# EAGLE schematic umami-blade (EAGLE 9.6.2)
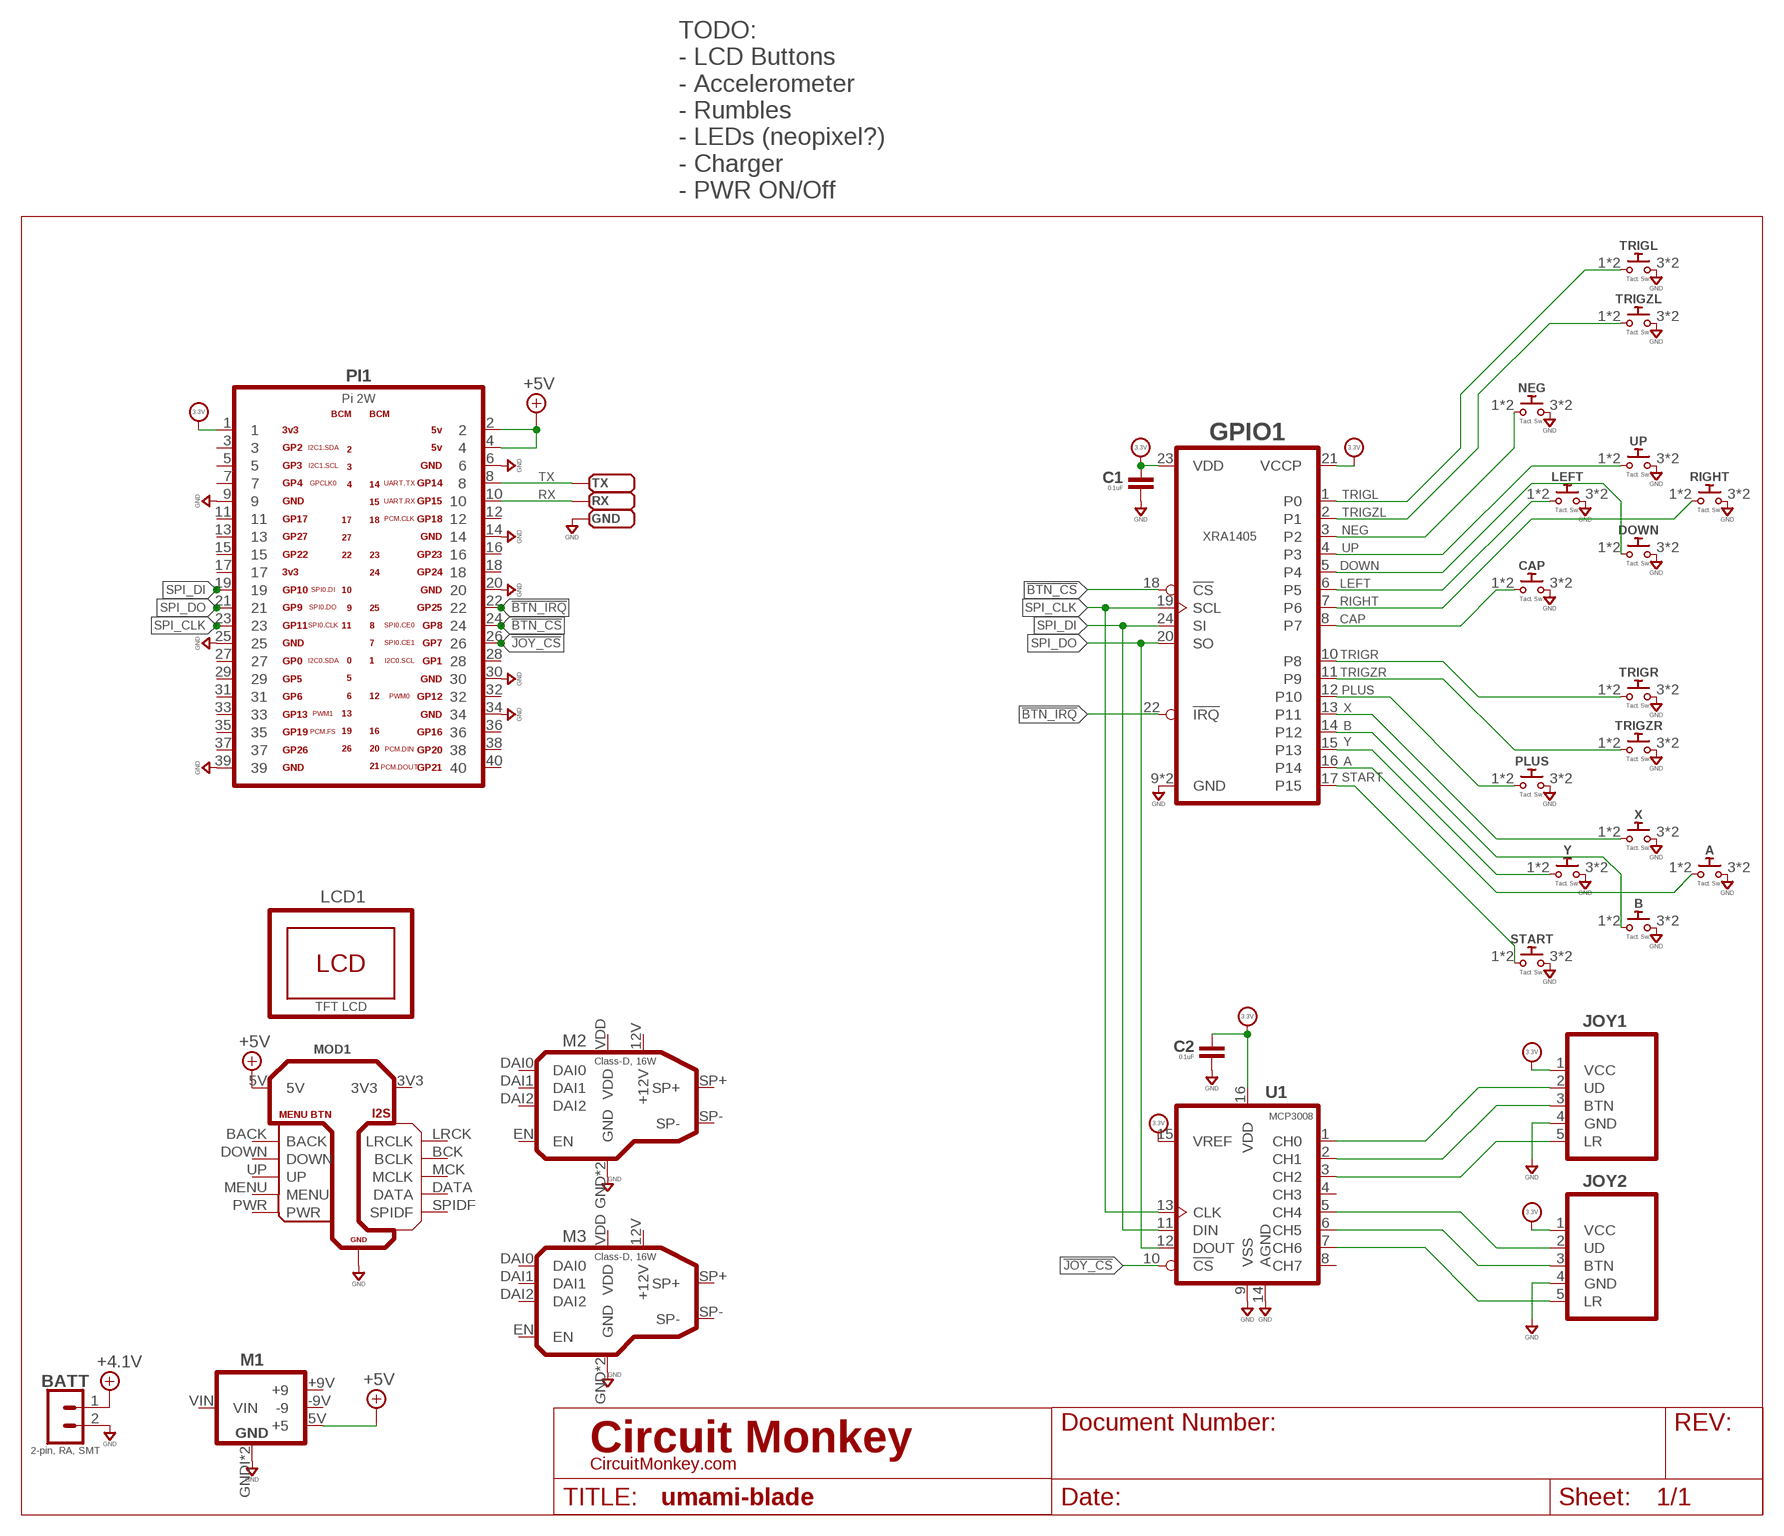
[diagram p0: schematic, sheet 1]

## Parts
A  Tact. Sw.  PUSHBTN-MOMB3FS  [B3FS]
B  Tact. Sw.  PUSHBTN-MOMB3FS  [B3FS]
BATT  2-pin, RA, SMT  02PRA-SMT  [S2B-PH-SM4-]
C1  0.1uF  CAPACITOR0603  [0603-CAP]
C2  0.1uF  CAPACITOR0603  [0603-CAP]
CAP  Tact. Sw.  PUSHBTN-MOMB3FS  [B3FS]
DOWN  Tact. Sw.  PUSHBTN-MOMB3FS  [B3FS]
GND  PADSMD-050X050  [SMD-050X050]
GPIO1  XRA1405  XRA1405IL24  [QFN-24]
JOY1  THUMBSTICKNINTENDO-SWITCH  [NINTENDO-JOYCON]
JOY2  THUMBSTICKNINTENDO-SWITCH  [NINTENDO-JOYCON]
LCD1  TFT LCD  LCD_MOCKUPPIM372  [PIMORONI_PIM372]
LEFT  Tact. Sw.  PUSHBTN-MOMB3FS  [B3FS]
M1  0128REV-A  [0128A]
M2  Class-D, 16W  0123REV-A  [0123A]
M3  Class-D, 16W  0123REV-A  [0123A]
MOD1  LCD_CONTROLLERPIMORONI-8IN  [PIMORONI-LCD-CONTROLLER]
NEG  Tact. Sw.  PUSHBTN-MOMB3FS  [B3FS]
PI1  Pi 2W  RASPBERRY_PI-ZERO-2W  [PI-ZERO-2W]
PLUS  Tact. Sw.  PUSHBTN-MOMB3FS  [B3FS]
RIGHT  Tact. Sw.  PUSHBTN-MOMB3FS  [B3FS]
RX  PADSMD-050X050  [SMD-050X050]
START  Tact. Sw.  PUSHBTN-MOMB3FS  [B3FS]
TRIGL  Tact. Sw.  PUSHBTN-MOMB3FS  [B3FS]
TRIGR  Tact. Sw.  PUSHBTN-MOMB3FS  [B3FS]
TRIGZL  Tact. Sw.  PUSHBTN-MOMB3FS  [B3FS]
TRIGZR  Tact. Sw.  PUSHBTN-MOMB3FS  [B3FS]
TX  PADSMD-050X050  [SMD-050X050]
U1  MCP3008  MCP3008SO16  [SO16]
UP  Tact. Sw.  PUSHBTN-MOMB3FS  [B3FS]
X  Tact. Sw.  PUSHBTN-MOMB3FS  [B3FS]
Y  Tact. Sw.  PUSHBTN-MOMB3FS  [B3FS]

## Nets
!BTN_CS: GPIO1.18(!CS) PI1.24
!BTN_IRQ: GPIO1.22(!IRQ) PI1.22
!JOY_CS: PI1.26 U1.10(!CS)
+3.3V: C1.1 C2.1 GPIO1.21(VCCP) GPIO1.23(VDD) JOY1.1(VCC) JOY2.1(VCC) PI1.1 U1.15(VREF) U1.16(VDD) ; supply symbol labelled 3.3V
+4.1V: BATT.1
+5V: M1.5V(+5) MOD1.5V PI1.2 PI1.4
A: A.1 A.2 GPIO1.16(P14)
B: B.1 B.2 GPIO1.14(P12)
CAP: CAP.1 CAP.2 GPIO1.8(P7)
DOWN: DOWN.1 DOWN.2 GPIO1.5(P4)
GND: A.3 A.4 B.3 B.4 BATT.2 C1.2 C2.2 CAP.3 CAP.4 DOWN.3 DOWN.4 GND.1(PAD) GPIO1.9(GND) GPIO1.PAD(GND) JOY1.4(GND) JOY2.4(GND) LEFT.3 LEFT.4 M1.GNDI(GND) M1.GNDO(GND) M2.GND M2.GND2(GND) M3.GND M3.GND2(GND) MOD1.GND@I2S(GND) MOD1.GND@MENU(GND) NEG.3 NEG.4 PI1.6 PI1.9 PI1.14 PI1.20 PI1.25 PI1.30 PI1.34 PI1.39 PLUS.3 PLUS.4 RIGHT.3 RIGHT.4 START.3 START.4 TRIGL.3 TRIGL.4 TRIGR.3 TRIGR.4 TRIGZL.3 TRIGZL.4 TRIGZR.3 TRIGZR.4 U1.9(VSS) U1.14(AGND) UP.3 UP.4 X.3 X.4 Y.3 Y.4
LEFT: GPIO1.6(P5) LEFT.1 LEFT.2
N$1: JOY1.3(BTN) U1.2(CH1)
N$3: JOY1.2(UD) U1.1(CH0)
N$4: JOY1.5(LR) U1.3(CH2)
N$5: JOY2.2(UD) U1.5(CH4)
N$6: JOY2.5(LR) U1.7(CH6)
N$7: JOY2.3(BTN) U1.6(CH5)
NEG: GPIO1.3(P2) NEG.1 NEG.2
PLUS: GPIO1.12(P10) PLUS.1 PLUS.2
RIGHT: GPIO1.7(P6) RIGHT.1 RIGHT.2
RX: PI1.10 RX.1(PAD)
SPI_CLK: GPIO1.19(SCL) PI1.23 U1.13(CLK)
SPI_DI: GPIO1.24(SI) PI1.19 U1.11(DIN)
SPI_DO: GPIO1.20(SO) PI1.21 U1.12(DOUT)
START: GPIO1.17(P15) START.1 START.2
TRIGL: GPIO1.1(P0) TRIGL.1 TRIGL.2
TRIGR: GPIO1.10(P8) TRIGR.1 TRIGR.2
TRIGZL: GPIO1.2(P1) TRIGZL.1 TRIGZL.2
TRIGZR: GPIO1.11(P9) TRIGZR.1 TRIGZR.2
TX: PI1.8 TX.1(PAD)
UP: GPIO1.4(P3) UP.1 UP.2
X: GPIO1.13(P11) X.1 X.2
Y: GPIO1.15(P13) Y.1 Y.2
Unconnected: M1.+9V(+9) M1.-9V(-9) M1.VIN M2.12V(+12V) M2.DAI0 M2.DAI1 M2.DAI2 M2.EN M2.SP+ M2.SP- M2.VDD M3.12V(+12V) M3.DAI0 M3.DAI1 M3.DAI2 M3.EN M3.SP+ M3.SP- M3.VDD MOD1.3V3 MOD1.BACK MOD1.BCK(BCLK) MOD1.DATA MOD1.DOWN MOD1.LRCK(LRCLK) MOD1.MCK(MCLK) MOD1.MENU MOD1.PWR MOD1.SPIDF MOD1.UP PI1.3 PI1.5 PI1.7 PI1.11 PI1.12 PI1.13 PI1.15 PI1.16 PI1.17 PI1.18 PI1.27 PI1.28 PI1.29 PI1.31 PI1.32 PI1.33 PI1.35 PI1.36 PI1.37 PI1.38 PI1.40 U1.4(CH3) U1.8(CH7)

## Notes on the sheet
- TODO:
  - LCD Buttons
  - Accelerometer
  - Rumbles
  - LEDs (neopixel?)
  - Charger
  - PWR ON/Off

## Library data of the parts
A B CAP DOWN LEFT NEG PLUS RIGHT START TRIGL TRIGR TRIGZL TRIGZR UP X Y = switch-smd:PUSHBTN-MOM: Pushbutton Switch; MFR: Omron; MPN: B3FS-10*
BATT = con-jst:02P: 2 pin connector; COST01: 0.60; COST10: 0.50; COST100: 0.40; MFR: JST; MPN: S2B-PH-SM4
C1 C2 = rlc:CAPACITOR: Capacitor; COST01: 0.12; COST10: 0.09; COST100: 0.05
GND RX TX = con-testpoints:PAD: Solder Pad
GPIO1 = co-exar:XRA1405: GPIO Expander with SPI; COST01: 2.80; MFR: Exar; MPN: XRA1405IL24
JOY1 JOY2 = switch-thd:THUMBSTICK: Nintendo Switch Thumbstick
LCD1 = display-lcd-oled:LCD_MOCKUP: LCD Screen - No connections; COST01: 75.00; MPN: PIM372
M1 = circuit-monkey-chips:0128: 0128 - Pos/Neg Voltage Booster, 3.7V in, -9,+9,+5 out.
M2 M3 = circuit-monkey-chips:0123: Class-D Amplifier, 16W; COST01: 13.46; COST10: 8.66; COST100: 5.67; MFR: Circuit Monkey; MPN: 0123A
MOD1 = display-lcd-oled:LCD_CONTROLLER: LCD Controller for Pimoroni
PI1 = co-raspberrypi:RASPBERRY_PI: Raspberry Pi Module; COST01: 40.00; COST10: 30.00; COST100: 15.00
U1 = co-microchip:MCP3008: ADC 8-ch with SPI; COST01: 2.75; COST10: 2.65; COST100: 2.10; MFR: Microchip; MPN: MCP3008-I/SL